# EAGLE design finalHDKShield (EAGLE 7.6.0)
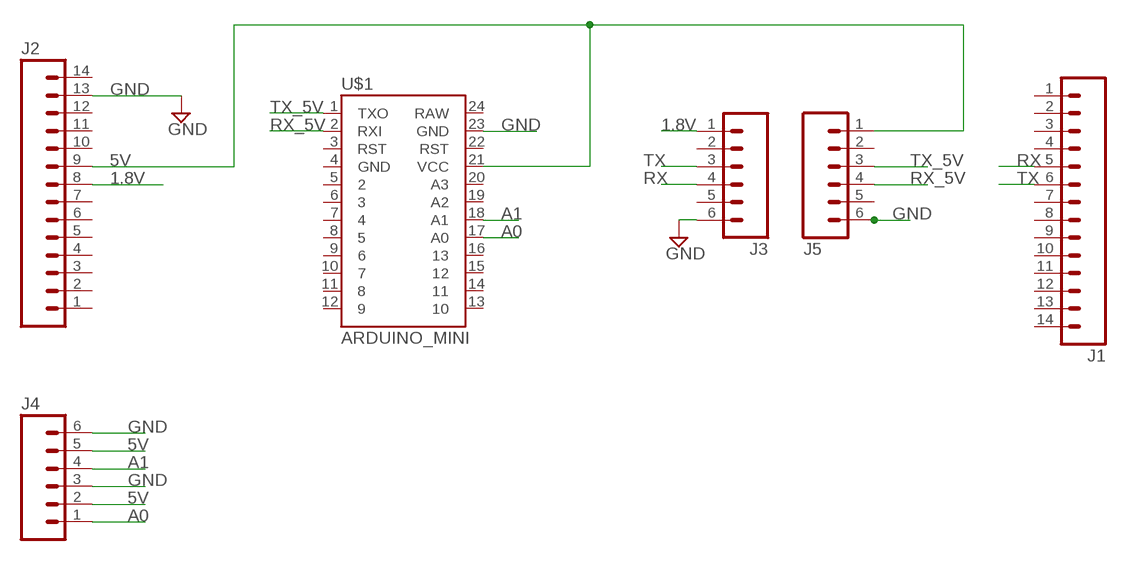
[diagram p0: schematic, sheet 1]

## Parts
J1  M14LONGPADS  [1X14-LONGPADS]
J2  M14LONGPADS  [1X14-LONGPADS]
J3  M06LONGPADS  [1X06_LONGPADS]
J4  M06LONGPADS  [1X06_LONGPADS]
J5  M06LONGPADS  [1X06_LONGPADS]
U$1  ARDUINO_MINI  [ARDUINO_MINI]

## Nets
1.8V: J2.8 J3.1
5V: J2.9 J4.2 J4.5 J5.1 U$1.21(VCC)
A0: J4.1 U$1.17(A0)
A1: J4.4 U$1.18(A1)
GND: J2.13 J3.6 J4.3 J4.6 J5.6 U$1.23(GND)
RX: J1.5 J3.4
RX_5V: J5.4 U$1.2(RXI)
TX: J1.6 J3.3
TX_5V: J5.3 U$1.1(TXO)
Unconnected: J1.1 J1.2 J1.3 J1.4 J1.7 J1.8 J1.9 J1.10 J1.11 J1.12 J1.13 J1.14 J2.1 J2.2 J2.3 J2.4 J2.5 J2.6 J2.7 J2.10 J2.11 J2.12 J2.14 J3.2 J3.5 J5.2 J5.5 U$1.3(RST) U$1.4(GND) U$1.5 U$1.6 U$1.7 U$1.8 U$1.9 U$1.10 U$1.11 U$1.12 U$1.13 U$1.14 U$1.15 U$1.16 U$1.19(A2) U$1.20(A3) U$1.22(RST) U$1.24(RAW)

## Library data of the parts
J1 J2 = SparkFun-Connectors:M14: Header 14 Standard 14-pin 0.1" header. Use with straight break away headers (SKU : PRT-00116), right angle break away headers (PRT-00553), swiss pins (PRT-00743), machine pins (PRT-00117), and female headers (PRT-00115).
J3-J5 = SparkFun-Connectors:M06: Header 6 Standard 6-pin 0.1" header. Use with straight break away headers (SKU : PRT-00116), right angle break away headers (PRT-00553), swiss pins (PRT-00743), machine pins (PRT-00117), and female headers (PRT-00115). Molex polarized connector foot print use with SKU : PRT-08094 with associated crimp pins and housings. NOTES ON THE VARIANTS LOCK and LOCK_LONGPADS... This footprint was designed to help hold the alignment of a through-hole component (i.e. 6-pin header) while soldering it into place. You may notice that each hole has been shifted either up or down by 0.005 of an inch from it's more standard position (which is a perfectly straight line). This slight alteration caused the pins (the squares in the middle) to touch the edges of the holes. Because they are alternating, it causes a "brace" to hold the component in place. 0.005 has proven to be the perfect amount of "off-center" position when using our standard breakaway headers. Although looks a little odd when you look at the bare footprint, once you have a header in there, the alteration is very hard to notice. Also,if you push a header all the way into place, it is covered up entirely on the bottom side. This idea of altering the position of holes to aid alignment will be further integrated into the Sparkfun Library for other footprints. It can help hold any component with 3 or more connection pins.
U$1 = SparkFun-Boards:ARDUINO_MINI: Arduino Pro Mini footprint

## Board
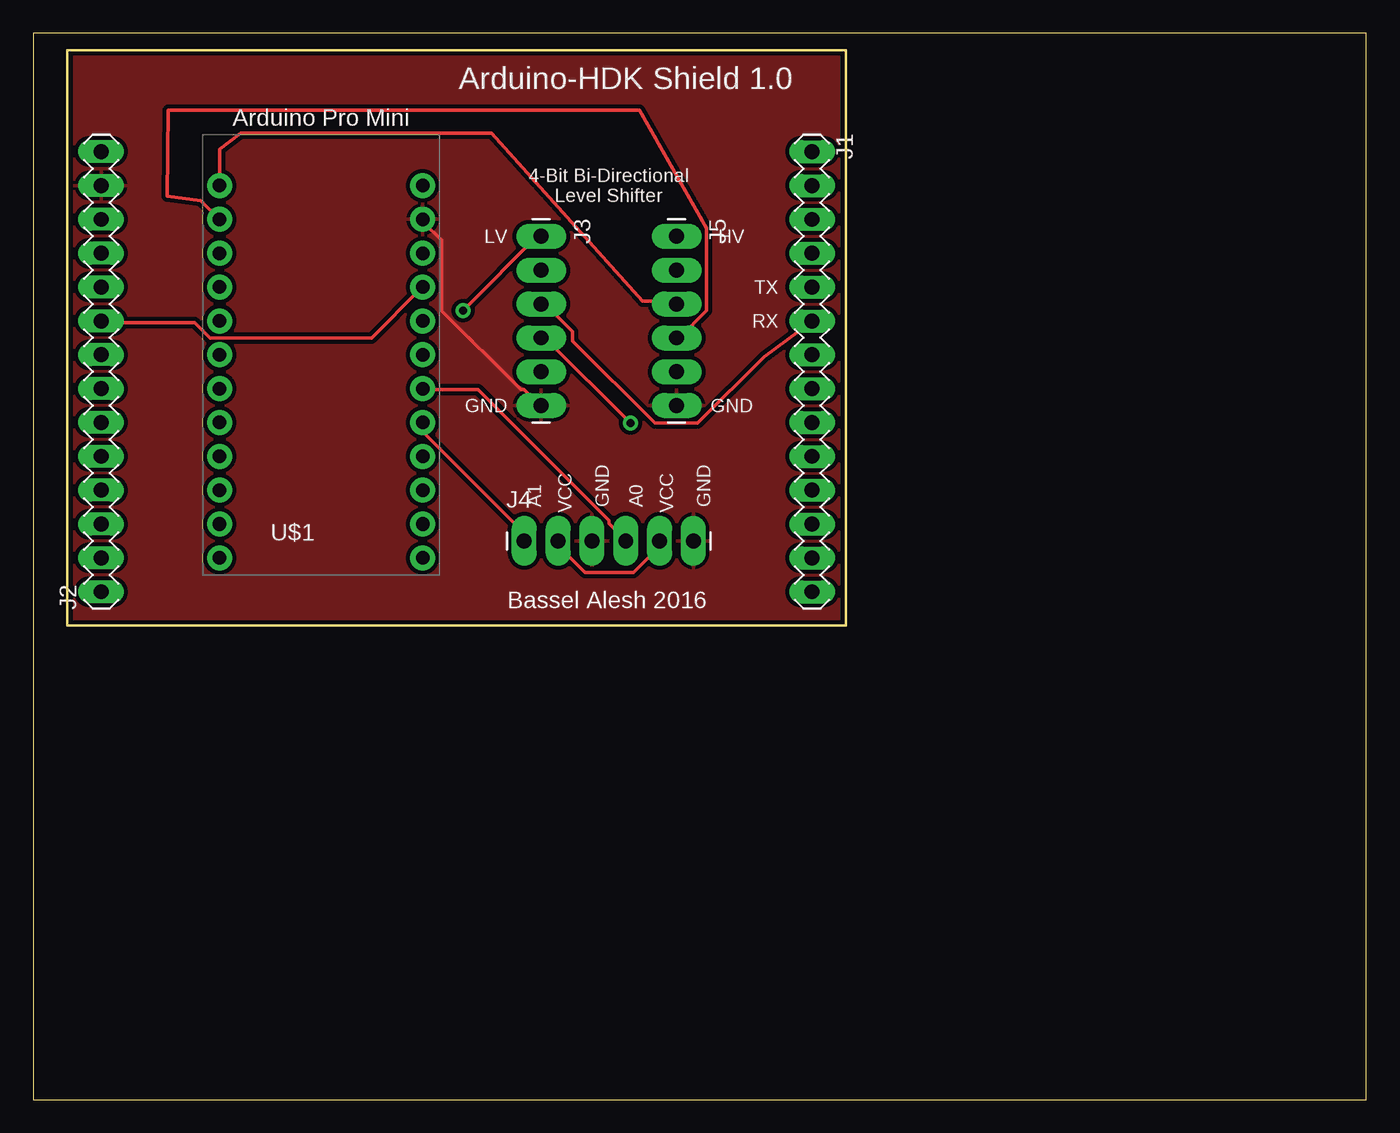
[diagram p1: board, top side]
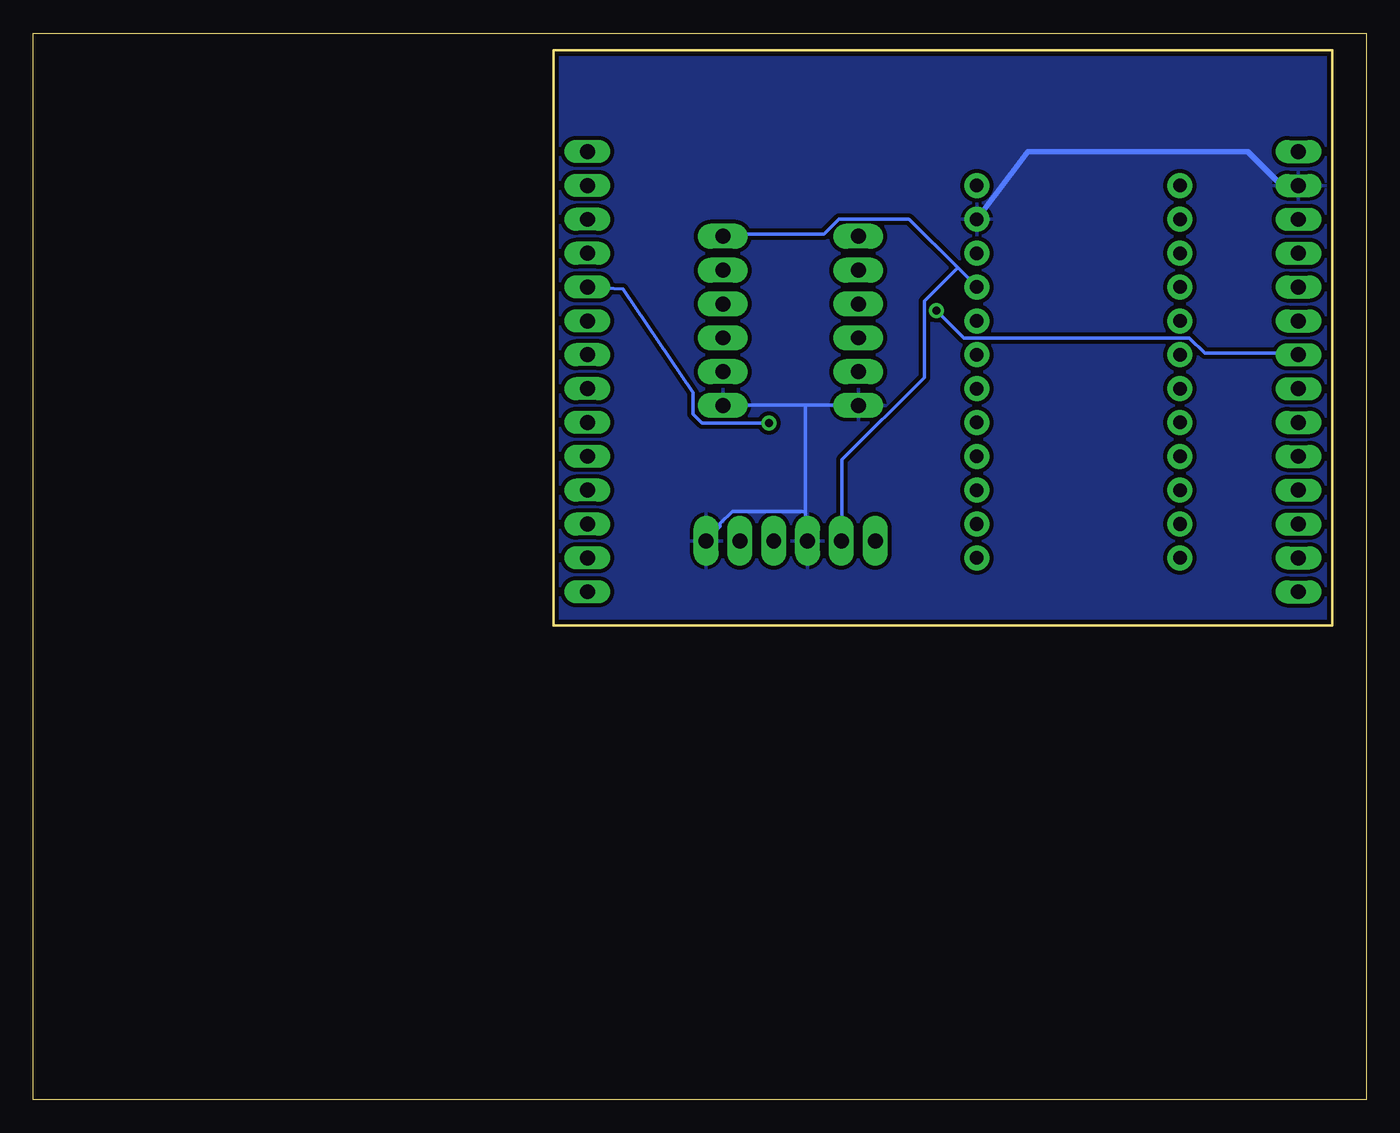
[diagram p2: board, bottom side, seen from below]

Size 100 x 80 mm. Coordinates in mm from the lower left corner, seen from the top.
Outline: 0,0 100,0 100,80 0,80 0,0
Outline: 2.54,78.74 2.54,35.56 60.96,35.56 60.96,78.74 2.54,78.74
Copper layers (1*16): Top 0.035mm / dielectric 1.5mm / Bottom 0.035mm
Design rules "SparkFun": minimum track width 8mil, minimum drill 20mil, track to track 8mil, track to pad 8mil, pad to pad 8mil, via to via 8mil, smd to smd 8mil, copper to edge 8mil, drill to drill 8mil, minimum pad ring 12mil, minimum via ring 10mil, stop-mask expansion 4mil, vias tented up to drill 20mil, thermal gap 10mil

### Footprints (pad centres in the part's own frame; a part is rotated, then mirrored left to right if it is on the bottom)
1X14-LONGPADS = drill 1.118 long: 1 0,0; 2 2.54,0; 3 5.08,0; 4 7.62,0; 5 10.16,0; 6 12.7,0; 7 15.24,0; 8 17.78,0; 9 20.32,0; 10 22.86,0; 11 25.4,0; 12 27.94,0; 13 30.48,0; 14 33.02,0
1X06_LONGPADS = drill 1.118 pad 1.88 long: 1 0,0; 2 2.54,0; 3 5.08,0; 4 7.62,0; 5 10.16,0; 6 12.7,0
ARDUINO_MINI = drill 1.016 pad 1.88: 1 -7.62,12.7; 2 -7.62,10.16; 3 -7.62,7.62; 4 -7.62,5.08; 5 -7.62,2.54; 6 -7.62,0; 7 -7.62,-2.54; 8 -7.62,-5.08; 9 -7.62,-7.62; 10 -7.62,-10.16; 11 -7.62,-12.7; 12 -7.62,-15.24; 13 7.62,-15.24; 14 7.62,-12.7; 15 7.62,-10.16; 16 7.62,-7.62; 17 7.62,-5.08; 18 7.62,-2.54; 19 7.62,0; 20 7.62,2.54; 21 7.62,5.08; 22 7.62,7.62; 23 7.62,10.16; 24 7.62,12.7

### Placement (x,y rotation side)
J1  58.42,71.12 270 top
J2  5.08,38.1 90 top
J3  38.1,64.77 270 top
J4  36.83,41.91 0 top
J5  48.26,64.77 270 top
U$1  21.59,55.88 0 top

### Tracks (layer width: path | path; a pad name or v marks a point on that pad's centre or on a via)
1.8V  (via drill 0.61)
  Top 0.254: v32.23,59.21 37.95,64.92 J3.1
  Bottom 0.254: v32.23,59.21 30.18,57.15 13.26,57.15 12.12,56.01 5.26,56.01 J2.8
5V
  Top 0.254: J4.2 39.55,41.83 39.55,41.38 41.38,39.55 45.03,39.55 46.86,41.38 46.86,41.83 J4.5 | J2.9 5.26,58.29 12.12,58.29 13.26,57.15 25.38,57.15 29.03,60.81 U$1.21
  Bottom 0.254: 30.63,62.41 29.26,61.04 U$1.21 | 30.63,62.41 34.29,66.06 39.55,66.06 40.69,64.92 48.23,64.92 J5.1 | 30.63,62.41 33.15,59.89 33.15,54.18 39.32,48.01 39.32,42.06 J4.2
A0
  Top 0.254: U$1.17 29.26,50.75 29.26,50.06 36.8,42.52 36.8,42.06 J4.1
A1
  Top 0.254: J4.4 44.35,42.06 43.2,43.2 43.2,43.43 33.38,53.26 29.26,53.26 U$1.18
GND
  Top 0.254: J3.6 37.95,52.12 36.8,53.26 36.58,53.26 30.63,59.21 30.63,64.47 29.26,65.84 U$1.23
  Bottom 0.254: 42.06,52.12 48.23,52.12 J5.6 | 42.06,52.12 38.18,52.12 J3.6 | 42.06,52.12 42.06,44.12 | 42.06,44.12 42.06,42.06 J4.3 | J4.6 48.46,42.98 48.46,43.2 47.55,44.12 42.06,44.12
  Bottom 0.406: U$1.23 25.4,71.12 8.89,71.12 6.35,68.58 J2.13
  pour Bottom (isolate 0.305): 2.54,78.74 60.96,78.74 60.96,35.56 2.54,35.56
  pour Top (isolate 0.305): 2.54,78.74 2.54,35.56 60.96,35.56 60.96,78.74
RX  (via drill 0.61)
  Top 0.254: v44.81,50.75 38.41,57.15 J3.4
  Bottom 0.254: v44.81,50.75 49.84,50.75 50.52,51.44 50.52,53.03 55.75,60.81 J1.5
RX_5V
  Top 0.254: U$1.2 12.57,67.44 10.03,67.77 10.13,74.22 45.49,74.22 50.52,65.38 50.52,59.21 48.46,57.15 J5.4
TX
  Top 0.254: J1.6 58.29,58.29 54.84,55.75 49.84,50.75 46.63,50.75 40.46,56.92 40.46,57.61 38.18,59.89 J3.3
TX_5V
  Top 0.254: J5.3 48.23,59.89 45.72,59.89 34.39,72.49 15.54,72.49 13.97,71.32 U$1.1

### Text on the board
tPlace: Arduino-HDK Shield 1.0 | Arduino Pro Mini | 4-Bit Bi-Directional / Level Shifter | LV | HV | TX | RX | GND | GND | VCC | VCC | A1 | GND | A0 | GND | Bassel Alesh 2016